# EAGLE schematic dcc-promicro (EAGLE 6.6.0)
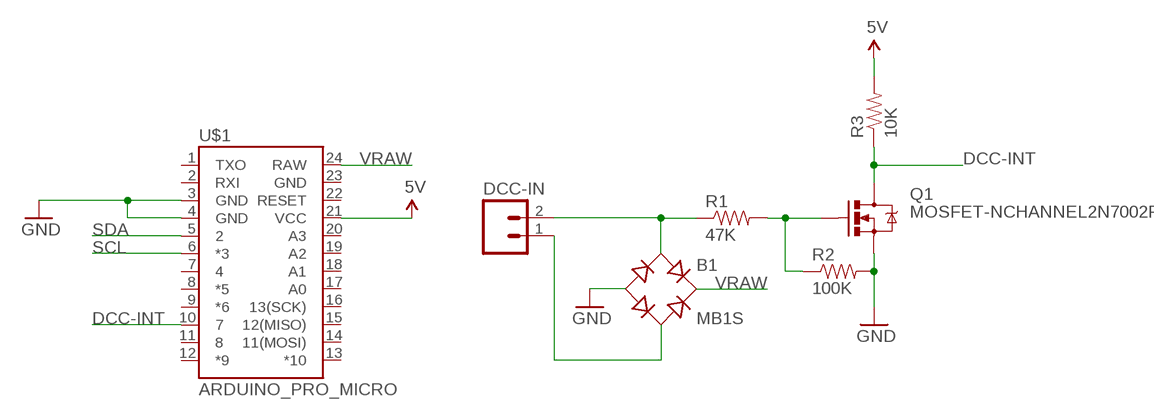
[diagram p0: schematic, sheet 1]

## Parts
B1  MB1S  [SOIC-4]
DCC-IN  M02PTH  [1X02]
Q1  MOSFET-NCHANNEL2N7002PW  [SOT323]
R1  47K  RESISTOR0603-RES  [0603-RES]
R2  100K  RESISTOR0603-RES  [0603-RES]
R3  10K  RESISTOR0603-RES  [0603-RES]
U$1  ARDUINO_PRO_MICRO  [ARDUINO_PRO_MICRO]

## Nets
5V: R3.2 U$1.21(VCC)
DCC-INT: Q1.3(D) R3.1 U$1.10
GND: B1.- Q1.2(S) R2.2 U$1.3(GND) U$1.4(GND)
N$1: Q1.1(G) R1.2 R2.1
N$3: B1.~1(AC1) DCC-IN.2 R1.1
N$4: B1.~2(AC2) DCC-IN.1
SCL: U$1.6(*3)
SDA: U$1.5
VRAW: B1.+ U$1.24(RAW)
Unconnected: U$1.1(TXO) U$1.2(RXI) U$1.7 U$1.8(*5) U$1.9(*6) U$1.11 U$1.12(*9) U$1.13(*10) U$1.14(11(MOSI)) U$1.15(12(MISO)) U$1.16(13(SCK)) U$1.17(A0) U$1.18(A1) U$1.19(A2) U$1.20(A3) U$1.22(RESET) U$1.23(GND)

## Library data of the parts
B1 = rectifier:MB*S: Bridge Rectifier Source: http://www.fairchildsemi.com/ds/MB/MB6S.pdf
DCC-IN = SparkFun-Connectors:M02: Standard 2-pin 0.1" header. Use with - straight break away headers ( PRT-00116) - right angle break away headers (PRT-00553) - swiss pins (PRT-00743) - machine pins (PRT-00117) - female headers (PRT-00115) Molex polarized connector foot print use with: PRT-08233 with associated crimp pins and housings. 2.54_SCREWTERM for use with PRT-10571. 3.5mm Screw Terminal footprints for PRT-08084 5mm Screw Terminal footprints for use with PRT-08433
Q1 = SparkFun-DiscreteSemi:MOSFET-NCHANNEL: Common NMOSFET Parts MFG P/N Store ID Prod ID FDD8780 TRANS-09984 SI7820DN TRANS-11055 FDS6630A IC-08089 2N7002PW TRANS-11151 FQP30N06L COM-10213 TRANS-10060 BSS123LT1G TRANS-08345 BSS138 TRANS-00830 BS170 2N7000; PROD_ID: TRANS-11151
R1-R3 = SparkFun-Passives:RESISTOR: Resistor Basic schematic elements and footprints for 0603, 1206, and PTH resistors.
U$1 = SparkFun-Boards:ARDUINO_PRO_MICRO